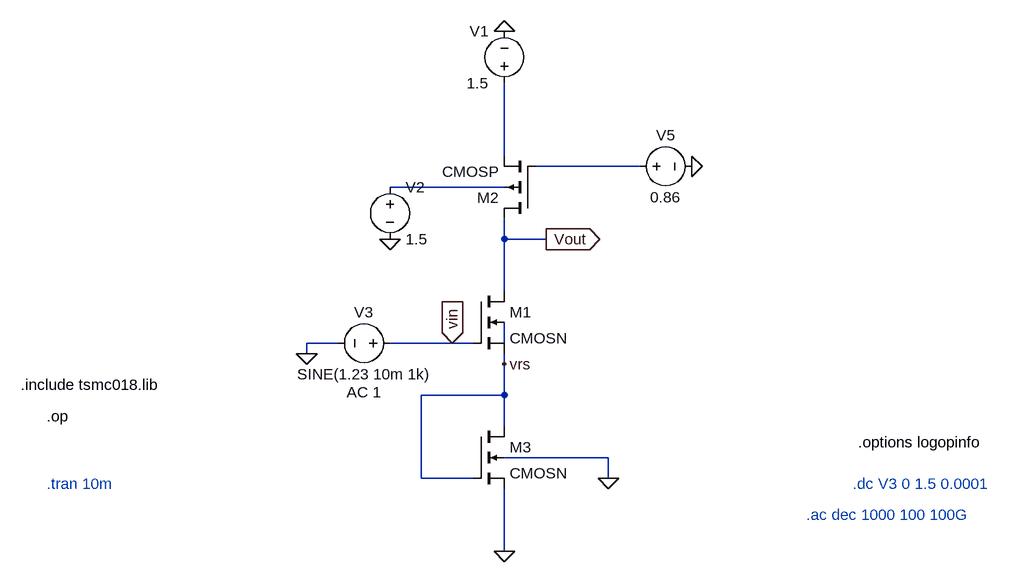
[diagram p0: schematic exp-02-c.asc]
exp-02-c.asc, the LTspice schematic file:
Version 4.1
SHEET 1 2412 680
WIRE 304 -176 304 -288
WIRE 512 -160 352 -160
WIRE 304 -128 128 -128
WIRE 304 -48 304 -80
WIRE 368 -48 304 -48
WIRE 304 32 304 -48
WIRE 48 112 0 112
WIRE 224 112 128 112
WIRE 256 112 224 112
WIRE 304 112 304 80
WIRE 0 128 0 112
WIRE 304 144 304 128
WIRE 304 192 304 144
WIRE 304 192 176 192
WIRE 304 240 304 192
WIRE 464 288 304 288
WIRE 176 320 176 192
WIRE 256 320 176 320
WIRE 464 320 464 288
WIRE 304 432 304 336
FLAG 304 432 0
FLAG 464 320 0
FLAG 0 128 0
FLAG 224 112 vin
IOPIN 224 112 In
FLAG 368 -48 Vout
IOPIN 368 -48 Out
FLAG 304 144 vrs
FLAG 304 -368 0
FLAG 128 -48 0
FLAG 592 -160 0
SYMBOL nmos4 256 32 R0
SYMATTR InstName M1
SYMATTR Value CMOSN
SYMATTR Value2 l=180n w=27.47u
SYMBOL pmos4 352 -80 R180
SYMATTR InstName M2
SYMATTR Value CMOSP
SYMATTR Value2 l=180n w=58.1u
SYMBOL nmos4 256 240 R0
SYMATTR InstName M3
SYMATTR Value CMOSN
SYMATTR Value2 l=180n w=18.27u
SYMBOL voltage 304 -272 R180
WINDOW 0 24 96 Left 2
WINDOW 3 24 16 Left 2
WINDOW 123 0 0 Left 0
WINDOW 39 0 0 Left 0
SYMATTR InstName V1
SYMATTR Value 1.5
SYMBOL voltage 144 112 R90
WINDOW 0 -32 56 VBottom 2
WINDOW 3 32 56 VTop 2
WINDOW 123 60 56 VTop 2
WINDOW 39 0 0 Left 0
SYMATTR InstName V3
SYMATTR Value SINE(1.23 10m 1k)
SYMATTR Value2 AC 1
SYMBOL voltage 496 -160 R270
WINDOW 0 32 56 VTop 2
WINDOW 3 -32 56 VBottom 2
WINDOW 123 0 0 Left 0
WINDOW 39 0 0 Left 0
SYMATTR InstName V5
SYMATTR Value 0.86
SYMBOL voltage 128 -144 R0
WINDOW 123 0 0 Left 0
WINDOW 39 0 0 Left 0
SYMATTR InstName V2
SYMATTR Value 1.5
TEXT -440 176 Left 2 !.include tsmc018.lib
TEXT -400 224 Left 2 !.op
TEXT -400 328 Left 2 ;.tran 10m
TEXT 768 376 Left 2 ;.ac dec 1000 100 100G
TEXT 840 328 Left 2 ;.dc V3 0 1.5 0.0001
TEXT 848 264 Left 2 !.options logopinfo

The netlist it stands for:
* exp-02-c.asc
M1 Vout vin vrs N004 CMOSN l=180n w=27.47u
M2 Vout N002 N001 N003 CMOSP l=180n w=58.1u
M3 vrs vrs 0 0 CMOSN l=180n w=18.27u
V1 N001 0 1.5
V3 vin 0 SINE(1.23 10m 1k) AC 1
V5 N002 0 0.86
V2 N003 0 1.5
.model NMOS NMOS
.model PMOS PMOS
.lib standard.mos
.include tsmc018.lib
.op
* .tran 10m
* .ac dec 1000 100 100G
* .dc V3 0 1.5 0.0001
.options logopinfo
.backanno
.end